# Altium schematic sheet KB CTRL.SchDoc
size A4
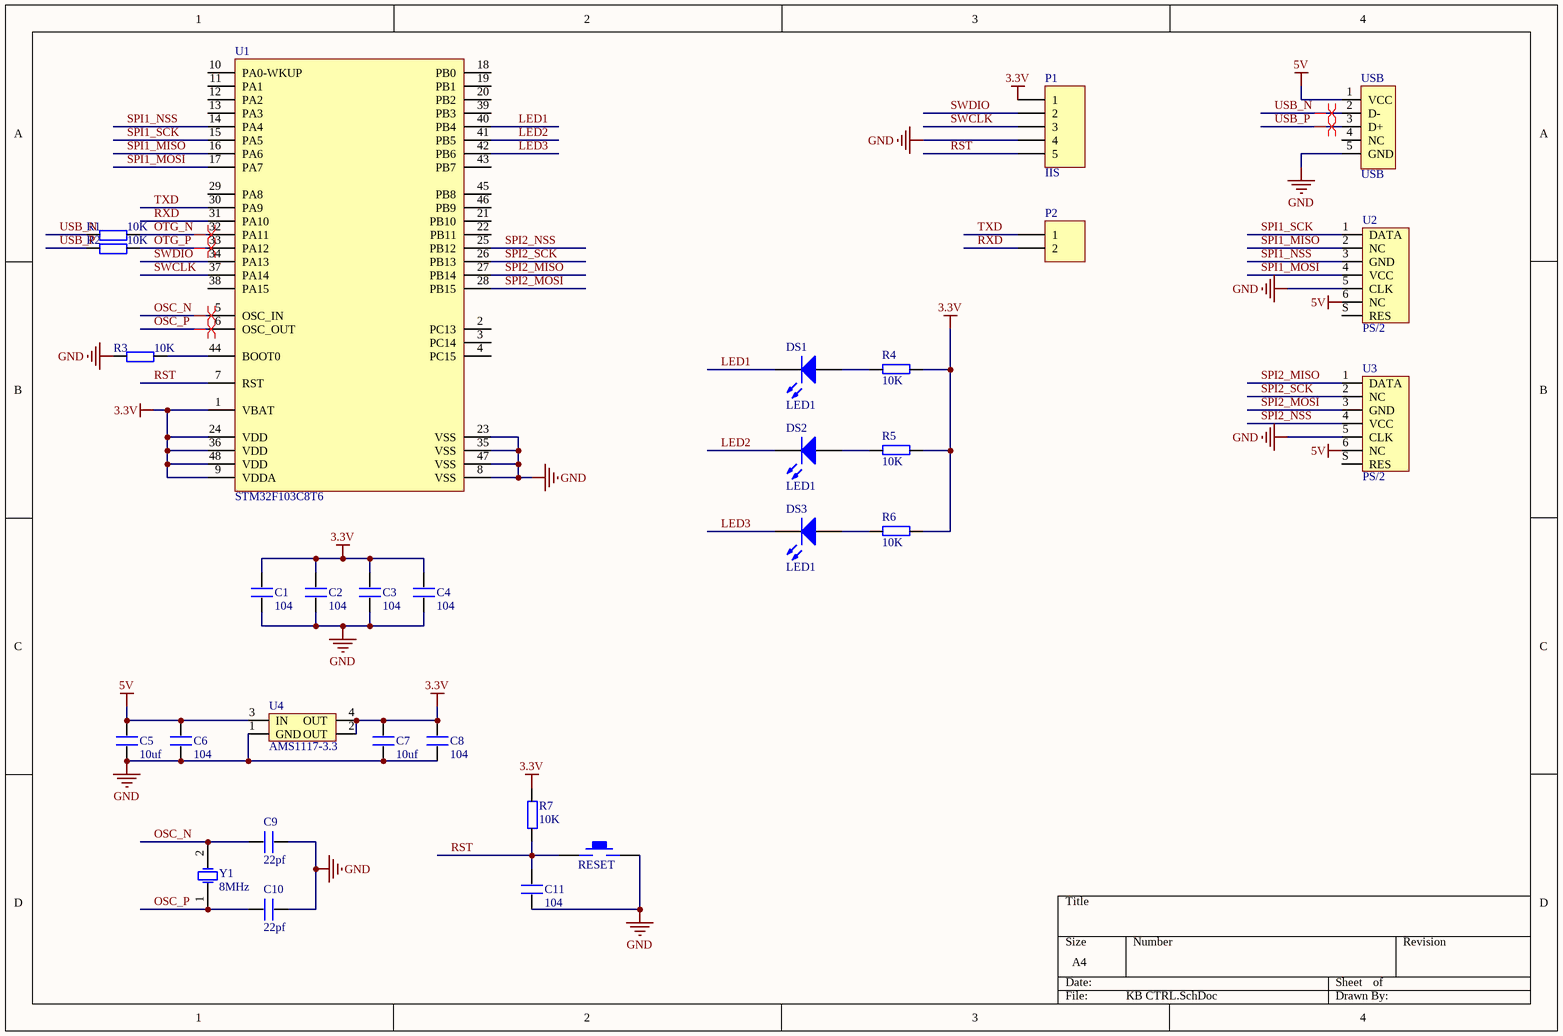
[diagram p0: KB CTRL.SchDoc]

## Parts
C1  104  [0603P]
C2  104  [0603P]
C3  104  [0603P]
C4  104  [0603P]
C5  10uf  [0603P]
C6  104  [0603P]
C7  10uf  [0603P]
C8  104  [0603P]
C9  22pf  [0603P]
C10  22pf  [0603P]
C11  104  [0603P]
DS1  LED1  [0603P]
DS2  LED1  [0603P]
DS3  LED1  [0603P]
P1  IIS  [HDR1X5]
P2  (no value)  [HDR1X2]
R1  10K  [0603P]
R2  10K  [0603P]
R3  10K  [0603P]
R4  10K  [0603P]
R5  10K  [0603P]
R6  10K  [0603P]
R7  10K  [0603P]
RESET  KEY_M  [KEY_M]  (value not drawn)
U1  STM32F103C8T6  [LQFP48]
U2  PS/2  [PS2-6PIN]
U3  PS/2  [PS2-6PIN]
U4  AMS1117-3.3  [AMS1117]
USB  USB  [USB/SM0.8-6H5]
Y1  8MHz  [XTAL_US]

## Nets
3.3V: C1.2 C2.2 C3.2 C4.2 C7.2 C8.2 P1.1 R4.1 R5.1 R6.1 R7.2 U1.1(VBAT) U1.9(VDDA) U1.24(VDD) U1.36(VDD) U1.48(VDD) U4.2(OUT) U4.4(OUT)
5V: C5.2 C6.2 U2.6(NC) U3.6(NC) U4.3(IN) USB.1(VCC)
GND: C1.1 C2.1 C3.1 C4.1 C5.1 C6.1 C7.1 C8.1 C9.1 C10.1 C11.1 P1.4 R3.1 RESET.2 U1.8(VSS) U1.23(VSS) U1.35(VSS) U1.47(VSS) U2.5(CLK) U3.5(CLK) U4.1(GND) USB.5(GND)
LED1: DS1.2(K) U1.40(PB4)
LED2: DS2.2(K) U1.41(PB5)
LED3: DS3.2(K) U1.42(PB6)
OSC_N: C9.2 U1.5(OSC_IN) Y1.2(OSC2)
OSC_P: C10.2 U1.6(OSC_OUT) Y1.1(OSC1)
OTG_N: R1.2 U1.32(PA11)
OTG_P: R2.2 U1.33(PA12)
RST: C11.2 P1.5 R7.1 RESET.1 U1.7(RST)
RXD: P2.2 U1.31(PA10)
SPI1_MISO: U1.16(PA6) U2.2(NC)
SPI1_MOSI: U1.17(PA7) U2.4(VCC)
SPI1_NSS: U1.14(PA4) U2.3(GND)
SPI1_SCK: U1.15(PA5) U2.1(DATA)
SPI2_MISO: U1.27(PB14) U3.1(DATA)
SPI2_MOSI: U1.28(PB15) U3.3(GND)
SPI2_NSS: U1.25(PB12) U3.4(VCC)
SPI2_SCK: U1.26(PB13) U3.2(NC)
SWCLK: P1.3 U1.37(PA14)
SWDIO: P1.2 U1.34(PA13)
TXD: P2.1 U1.30(PA9)
USB_N: R1.1 USB.2(D-)
USB_P: R2.1 USB.3(D+)
NetDS1_1: DS1.1(A) R4.2
NetDS2_1: DS2.1(A) R5.2
NetDS3_1: DS3.1(A) R6.2
NetR3_2: R3.2 U1.44(BOOT0)

Not connected (* = marked no-connect by the designer): U1 2(PC13) 3(PC14) 4(PC15) 10(PA0-WKUP) 11(PA1) 12(PA2) 13(PA3) 18(PB0) 19(PB1) 20(PB2) 21(PB10) 22(PB11) 29(PA8) 38(PA15) 39(PB3) 43(PB7) 45(PB8) 46(PB9); U2 S(RES); U3 S(RES); USB 4(NC)

## Layout directives
differential pair: OSC_N, OSC_P, OTG_N, OTG_P, USB_N, USB_P

## Library data of the parts
C1-C11 = C
DS1-DS3 = LED2: Typical RED, GREEN, YELLOW, AMBER GaAs LED; Published: 8-Jun-2000; LatestRevisionDate: 17-Jul-2002; LatestRevisionNote: Re-released for DXP Platform.; PackageDocument: Feb-2002; PackageReference: 3.2X1.6X1.1; Publisher: Altium Limited
P1 = Header 5: Header, 5-Pin; LatestRevisionDate: 17-Jul-2002; LatestRevisionNote: Re-released for DXP Platform.; Publisher: Altium Limited
P2 = Header 2: Header, 2-Pin; LatestRevisionDate: 17-Jul-2002; LatestRevisionNote: Re-released for DXP Platform.; Publisher: Altium Limited
R1-R7 = R
U2 U3 = P/S2
U4 = AMS1117
USB = USB5
Y1 = XTAL: Crystal Oscillator; Published: 8-Jun-2000; LatestRevisionDate: 17-Jul-2002; LatestRevisionNote: Re-released for DXP Platform.; Publisher: Altium Limited